# EAGLE schematic completion (EAGLE 6.0)
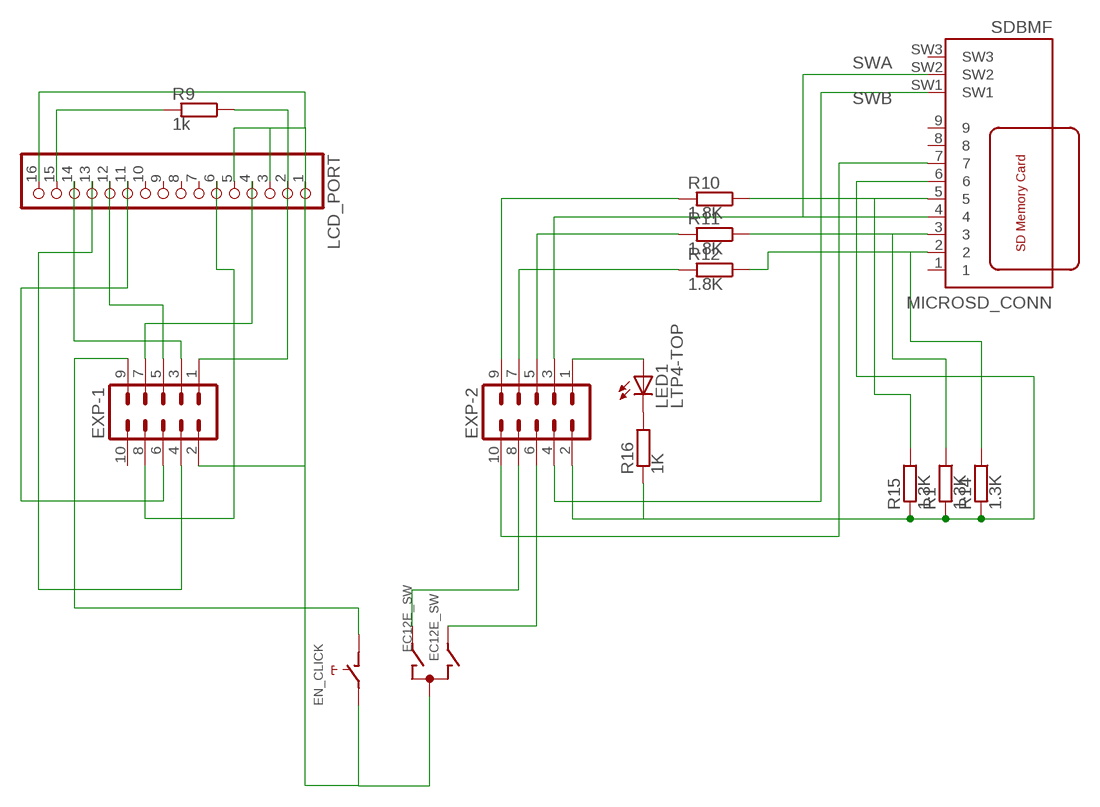
[diagram p0: schematic, sheet 1]

## Parts
EN_CLICK  EC12E_SW  [ALPS_EC12E_SW]
EXP-1  MA05-2  [MA05-2]
EXP-2  MA05-2  [MA05-2]
LCD_PORT  PINHD-1X16  [1X16]
LED1  LTP4-TOP  [P47F-TOP]
MICROSD_CONN  SDBMF  [SDBMF-009XXBXX2]
R1  1.3K  BVS  [BVS]
R9  1k  BVS  [BVS]
R10  1.8K  BVS  [BVS]
R11  1.8K  BVS  [BVS]
R12  1.8K  BVS  [BVS]
R14  1.3K  BVS  [BVS]
R15  1.3K  BVS  [BVS]
R16  1K  BVS  [BVS]

## Nets
N$1: EXP-1.1 LCD_PORT.2 R9.1
N$2: EN_CLICK.D EXP-1.9
N$3: EN_CLICK.C EN_CLICK.E EXP-1.2 LCD_PORT.1
N$4: EXP-1.7 LCD_PORT.4
N$5: EXP-1.5 LCD_PORT.12
N$6: EXP-1.3 LCD_PORT.14
N$7: EXP-1.8 LCD_PORT.6
N$8: LCD_PORT.3 LCD_PORT.5 LCD_PORT.16
N$9: LCD_PORT.15 R9.2
N$10: EXP-1.6 LCD_PORT.11
N$11: EXP-1.4 LCD_PORT.13
N$12: EN_CLICK.B EXP-2.6
N$13: EN_CLICK.A EXP-2.8
N$14: EXP-2.10 MICROSD_CONN.7
N$15: EXP-2.2 MICROSD_CONN.6 R1.2 R14.2 R15.2 R16.2
N$17: EXP-2.1 LED1.A
N$18: LED1.C R16.1
N$20: MICROSD_CONN.5 R10.1 R15.1
N$21: EXP-2.9 R10.2
N$22: MICROSD_CONN.3 R1.1 R11.1
N$23: EXP-2.5 R11.2
N$24: MICROSD_CONN.2 R12.1 R14.1
N$25: EXP-2.7 R12.2
SWA: EXP-2.3 MICROSD_CONN.4 MICROSD_CONN.SW2
SWB: EXP-2.4 MICROSD_CONN.SW1
Unconnected: EN_CLICK.GND1(G) EN_CLICK.GND2(G) EXP-1.10 LCD_PORT.7 LCD_PORT.8 LCD_PORT.9 LCD_PORT.10 MICROSD_CONN.1 MICROSD_CONN.8 MICROSD_CONN.9 MICROSD_CONN.SW3

## Library data of the parts
EN_CLICK = switch-alps:EC12E_SW: ALPS rotary Encoder EC12E series with switch; MPN: EC12E2424407; OC_FARNELL: 1520813; OC_NEWARK: 74M1068
EXP-1 EXP-2 = con-lstb:MA05-2: PIN HEADER; OC_FARNELL: unknown; OC_NEWARK: unknown
LCD_PORT = pinhead:PINHD-1X16: PIN HEADER
LED1 = led:*P4: PointLED® Enhanced Thinfilm LED TOP & BOTTOM mount LS P47F, LR P47F, LA P47F, LY P47F, LT P4SG, LB P4SG, LW P4SG Source: http://catalog.osram-os.com .. LA_LR_LS_LY_P47F_Pb_free.pdf
MICROSD_CONN = farnell:SDBMF: SD MEMORY CARD PUSH-PUSH WITH CONNECTOR TYPE B (BIG SWUÌTCH #3) KINGFONT PRECISION INDUSTIAL CO., LTD Source: http://www.farnell.com/datasheets/74273.pdf Best.-Nr.: 9186174 Hersteller: MULTICOMP Herstellerbez.: SDBMF-00915B0T2
R1 R9-R12 R14-R16 = resistor-shunt:BVS: SMD SHUNT RESISTOR; OC_FARNELL: unknown; OC_NEWARK: unknown